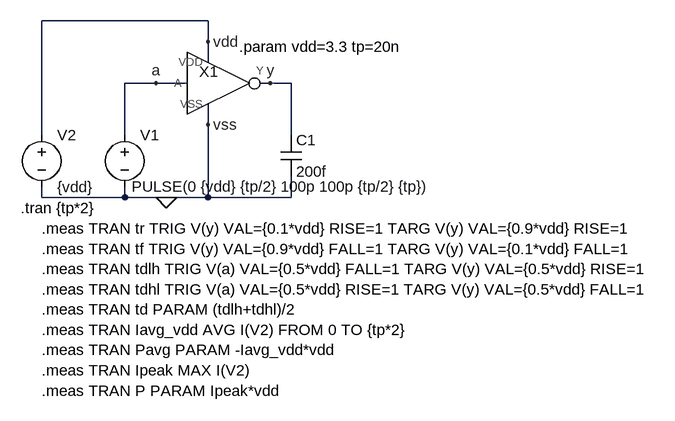
[diagram p0: schematic inv1x_tb_tran.asc]
inv1x_tb_tran.asc, the LTspice schematic file:
Version 4.1
SHEET 1 1096 680
WIRE 176 64 -80 64
WIRE 176 96 176 64
WIRE 176 128 176 96
WIRE 96 160 48 160
WIRE 144 160 96 160
WIRE 272 160 256 160
WIRE 304 160 272 160
WIRE 176 224 176 192
WIRE -80 240 -80 64
WIRE 48 240 48 160
WIRE 304 240 304 160
WIRE -80 336 -80 320
WIRE 48 336 48 320
WIRE 48 336 -80 336
WIRE 112 336 48 336
WIRE 176 336 176 224
WIRE 176 336 112 336
WIRE 304 336 304 304
WIRE 304 336 176 336
FLAG 96 160 a
FLAG 176 96 vdd
FLAG 176 224 vss
FLAG 112 336 0
FLAG 272 160 y
SYMBOL voltage 48 224 R0
WINDOW 123 0 0 Left 0
WINDOW 39 0 0 Left 0
WINDOW 3 11 95 Left 2
SYMATTR Value PULSE(0 {vdd} {tp/2} 100p 100p {tp/2} {tp})
SYMATTR InstName V1
SYMBOL voltage -80 224 R0
WINDOW 123 0 0 Left 0
WINDOW 39 0 0 Left 0
SYMATTR InstName V2
SYMATTR Value {vdd}
SYMBOL cap 288 240 R0
SYMATTR InstName C1
SYMATTR Value 200f
SYMBOL diglib\\inv1x\\inv1x 208 160 R0
SYMATTR InstName X1
TEXT -112 352 Left 2 !.tran {tp*2}
TEXT 224 104 Left 2 !.param vdd=3.3 tp=20n
TEXT -80 384 Left 2 !.meas TRAN tr TRIG V(y) VAL={0.1*vdd} RISE=1 TARG V(y) VAL={0.9*vdd} RISE=1\n.meas TRAN tf TRIG V(y) VAL={0.9*vdd} FALL=1 TARG V(y) VAL={0.1*vdd} FALL=1\n.meas TRAN tdlh TRIG V(a) VAL={0.5*vdd} FALL=1 TARG V(y) VAL={0.5*vdd} RISE=1\n.meas TRAN tdhl TRIG V(a) VAL={0.5*vdd} RISE=1 TARG V(y) VAL={0.5*vdd} FALL=1 \n.meas TRAN td PARAM (tdlh+tdhl)/2  \n.meas TRAN Iavg_vdd AVG I(V2) FROM 0 TO {tp*2}\n.meas TRAN Pavg PARAM -Iavg_vdd*vdd\n.meas TRAN Ipeak MAX I(V2)\n.meas TRAN P PARAM Ipeak*vdd

The netlist it stands for:
* inv1x_tb_tran.asc
V1 a 0 PULSE(0 {vdd} {tp/2} 100p 100p {tp/2} {tp})
V2 vdd 0 {vdd}
C1 y 0 200f
X§X1 a vdd 0 y inv1x  ; pins A VDD VSS Y
.tran {tp*2}
.param vdd=3.3 tp=20n
.meas TRAN tr TRIG V(y) VAL={0.1*vdd} RISE=1 TARG V(y) VAL={0.9*vdd} RISE=1
.meas TRAN tf TRIG V(y) VAL={0.9*vdd} FALL=1 TARG V(y) VAL={0.1*vdd} FALL=1
.meas TRAN tdlh TRIG V(a) VAL={0.5*vdd} FALL=1 TARG V(y) VAL={0.5*vdd} RISE=1
.meas TRAN tdhl TRIG V(a) VAL={0.5*vdd} RISE=1 TARG V(y) VAL={0.5*vdd} FALL=1
.meas TRAN td PARAM (tdlh+tdhl)/2
.meas TRAN Iavg_vdd AVG I(V2) FROM 0 TO {tp*2}
.meas TRAN Pavg PARAM -Iavg_vdd*vdd
.meas TRAN Ipeak MAX I(V2)
.meas TRAN P PARAM Ipeak*vdd
.backanno
.end